# Altium schematic sheet MainConnector.SchDoc
size A; SheetNumber: 8; SheetTotal: 10
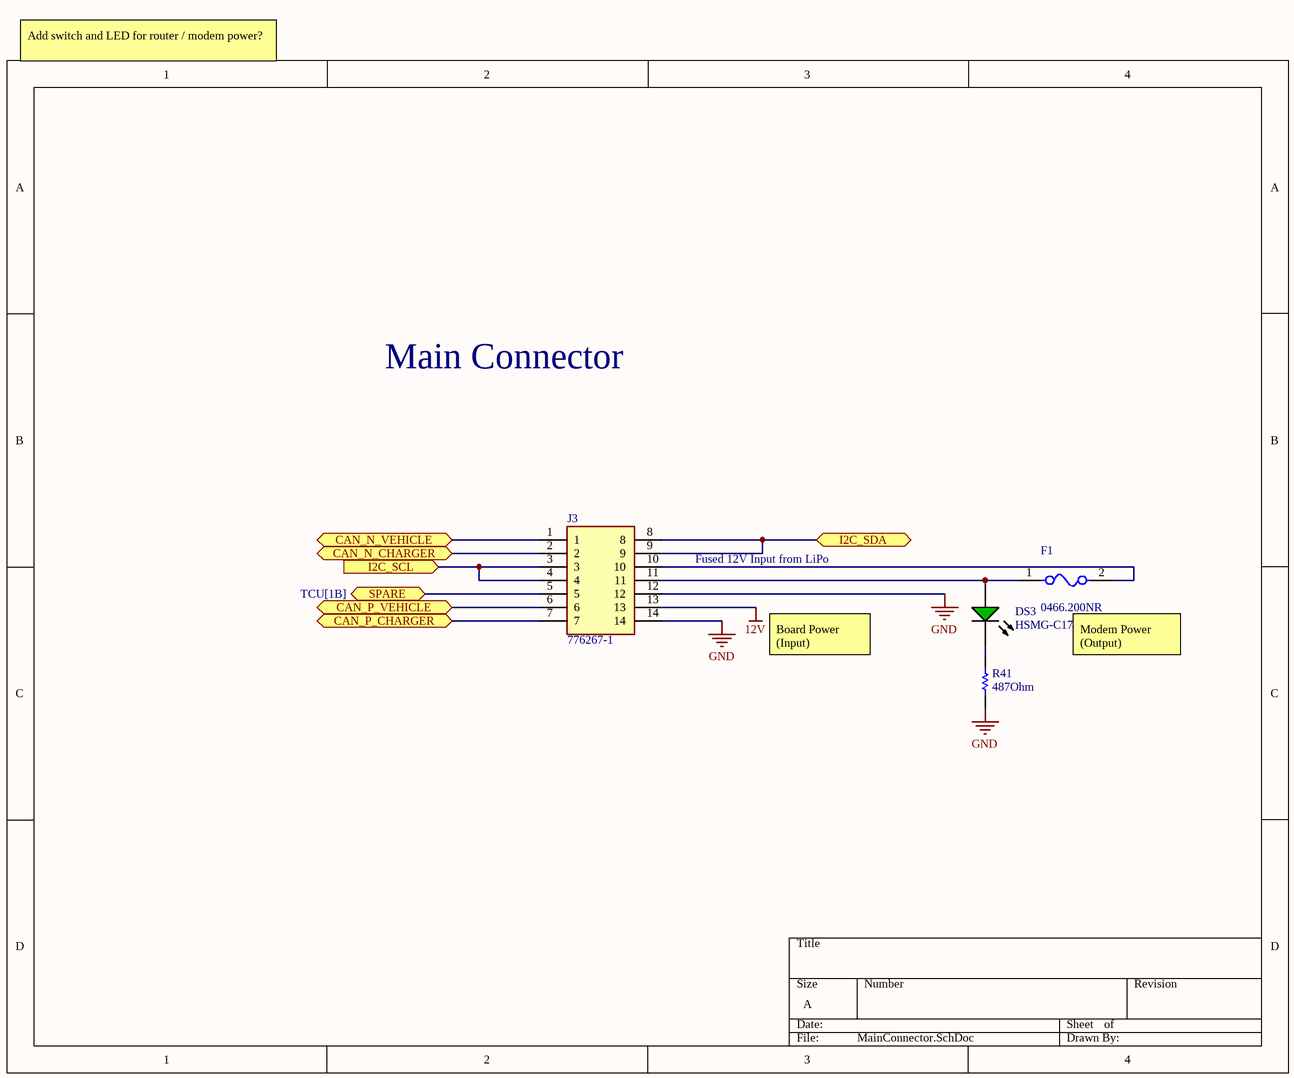
[diagram p0: MainConnector.SchDoc]

## Parts
DS3  HSMG-C170  [AVAG-HSMX-C170_V]
F1  0466.200NR  [FP-0466-MFG]
J3  776267-1  [776267-1]
R41  value 487Ohm  [RESC2013X60X35NL10T20]  (hidden comment: RC0805FR-07487RL)

## Ports
CAN_N_CHARGER (bidir, see TCU[1B]), CAN_N_VEHICLE (bidir, see TCU[1B]), CAN_P_CHARGER (bidir, see TCU[1B]), CAN_P_VEHICLE (bidir, see TCU[1B]), I2C_SCL (in, see TCU[1A], IMU[3B]), I2C_SDA (bidir, see TCU[1B], IMU[3B]), SPARE (bidir, see TCU[1B])

## Nets
12V: J3.13
GND: J3.12 J3.14 R41.1
CAN_N_CHARGER: J3.2 ; port CAN_N_CHARGER
CAN_N_VEHICLE: J3.1 ; port CAN_N_VEHICLE
CAN_P_CHARGER: J3.7 ; port CAN_P_CHARGER
CAN_P_VEHICLE: J3.6 ; port CAN_P_VEHICLE
I2C_SCL: J3.3 J3.4 ; port I2C_SCL
I2C_SDA: J3.8 J3.9 ; port I2C_SDA
SPARE: J3.5 ; port SPARE
NetDS3_1: DS3.1(A) F1.1 J3.11
NetDS3_2: DS3.2(K) R41.2
NetF1_2: F1.2 J3.10

## Notes on the sheet
- Add switch and LED for router / modem power?
- Main Connector
- Fused 12V Input from LiPo
- Board Power (Input)
- (near F1) Modem Power (Output)

## Library data of the parts
DS3 = CMP-2000-05062-1: Chip LED, Green, 2.2 V, -40 to 85 degC, 2-Pin SMD, Pb-Free, Tape and Reel; Manufacturer: Avago; No. of Pins: 2; Peak Wavelength: 570nm; SVHC: NoSVHC(16-Jun-2014); Dominant Wavelength: 572nm; Forward Current If: 20mA; Viewing Angle: 170deg; Lens Shape: Rectangular; PIV Max: 5V; External Width: 1.25mm; LED Type: Standard; External Depth: 0.8mm; Opto Mounting Orientation: Top; Luminous Intensity: 15mcd; Luminous Intensity Min: 4mcd; Forward Voltage VF Max: 2.6V; External Length / Height: 2mm; Bulb Size: 1.25mmx1.4mm; Light Area Height: 1mm; Voltage Vf Typ: 2.2V; Operating Temperature Max: 85degC; Datasheet Version: Oct-08; MSL: MSL2A-4weeks; Peak Forward Current: 20mA; Package Description: 2-Pin Surface Mount Device, Body 2 x 1.25 mm, Height 0.8 mm; Datasheet URL: https://datasheet.ciiva.com/29280/180495-da-01-en-chip-led-hsmg-c170-gelb-gruen-29280971.pdf; Storage Temperature Min: -40degC; LED Colour: Green; Wavelength Typ: 570nm; Mounting Type: SMD; Forward Current If Max: 20mA; Dominant Wavelength Typ: 572nm; LED Mounting: SMD; Operating Temperature Range: -30degCto+85degC; Operating Temperature Min: -30degC; Manufacturer URL: http://www.avagotech.com/; Packaging: CutTape; Luminous Intensity Typ: 15mcd; Package Reference: HSMX-C170; Storage Temperature Max: 85degC; Opto Case Style: SMD; Forward Voltage: 2.2V
F1 = CMP-08605-000081-1: FUSE BOARD MNT 200MA 125VAC/VDC; Body Material: Thermoplastic; Voltage Rating: 125V; Fuse Type: Board Mount (Cartridge Style Excluded); Resistance: 1.15R; Approvals: UL; DC Cold Resistance: 1.16R; Case Code (Metric): 3216; Depth: 1.52mm; Case/Package: 1206; Lead Free: Lead Free; Length: 3.18mm; Max Operating Temperature: 90°C; Case Code (Imperial): 1206; Terminal Material: Copper; Radiation Hardening: No; Working Voltage: 125V; Packaging: Tape and Reel; Width: 0.06inch; Housing Material: Ceramic; Voltage Rating (AC): 125V; Current Rating: 200mA; Fuse Current: 200mA; Package Quantity: 5000; Height: 0.023inch; Termination: SMD/SMT; Voltage Rating (DC): 125V; Mount: Surface Mount; Min Operating Temperature: -55°C; Number of Pins: 2
J3 = 776267-1: Connector; Manufacturer_Name: TE Connectivity; Datasheet Link: http://www.te.com/commerce/DocumentDelivery/DDEController?Action=srchrtrv&DocNm=776267&DocType=Customer+Drawing&DocLang=English; Manufacturer_Part_Number: 776267-1; Mouser Part Number: 571-776267-1; Mouser Price/Stock: https://www.mouser.co.uk/ProductDetail/TE-Connectivity/776267-1?qs=tLAa1RwIH6fSgzpmDTOXQA%3D%3D; Arrow Part Number: 776267-1; Arrow Price/Stock: https://www.arrow.com/en/products/776267-1/te-connectivity?region=europe
R41 = CMP-2001-01162-1: Manufacturer: Yageo; Part Number: RC0805FR-07487RL